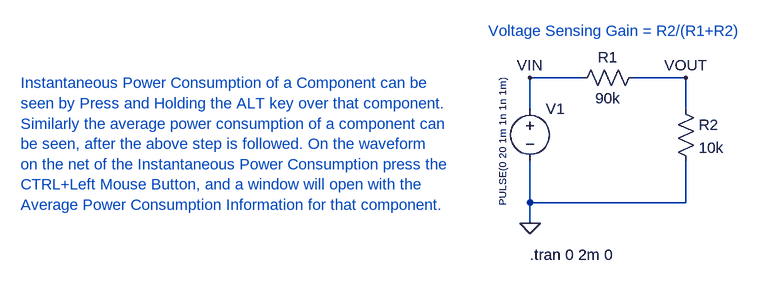
[diagram p0: schematic 01-Transient Simulation.asc]
01-Transient Simulation.asc, the LTspice schematic file:
Version 4
SHEET 1 880 680
WIRE 64 80 -16 80
WIRE 224 80 144 80
WIRE -16 128 -16 80
WIRE 224 128 224 80
WIRE -16 272 -16 208
WIRE 224 272 224 208
WIRE 224 272 -16 272
WIRE -16 304 -16 272
FLAG -16 304 0
FLAG -16 80 VIN
FLAG 224 80 VOUT
SYMBOL voltage -16 112 R0
WINDOW 3 -42 -28 VRight 1
WINDOW 123 0 0 Left 0
WINDOW 39 0 0 Left 0
SYMATTR InstName V1
SYMATTR Value PULSE(0 20 1m 1n 1n 1m)
SYMBOL res 48 96 R270
WINDOW 0 32 56 VTop 2
WINDOW 3 0 56 VBottom 2
SYMATTR InstName R1
SYMATTR Value 90k
SYMBOL res 208 112 R0
SYMATTR InstName R2
SYMATTR Value 10k
TEXT -80 8 Left 2 ;Voltage Sensing Gain = R2/(R1+R2)
TEXT -16 352 Left 2 !.tran 0 2m 0
TEXT -800 88 Left 2 ;Instantaneous Power Consumption of a Component can be \nseen by Press and Holding the ALT key over that component.\nSimilarly the average power consumption of a component can\nbe seen, after the above step is followed. On the waveform\non the net of the Instantaneous Power Consumption press the\nCTRL+Left Mouse Button, and a window will open with the\nAverage Power Consumption Information for that component.

The netlist it stands for:
* 01-Transient Simulation.asc
V1 VIN 0 PULSE(0 20 1m 1n 1n 1m)
R1 VIN VOUT 90k
R2 VOUT 0 10k
* Voltage Sensing Gain = R2/(R1+R2)
.tran 0 2m 0
* Instantaneous Power Consumption of a Component can be
* seen by Press and Holding the ALT key over that component.
* Similarly the average power consumption of a component can
* be seen, after the above step is followed. On the waveform
* on the net of the Instantaneous Power Consumption press the
* CTRL+Left Mouse Button, and a window will open with the
* Average Power Consumption Information for that component.
.backanno
.end